# EAGLE design Buck V2.1 (EAGLE 9.4.2)
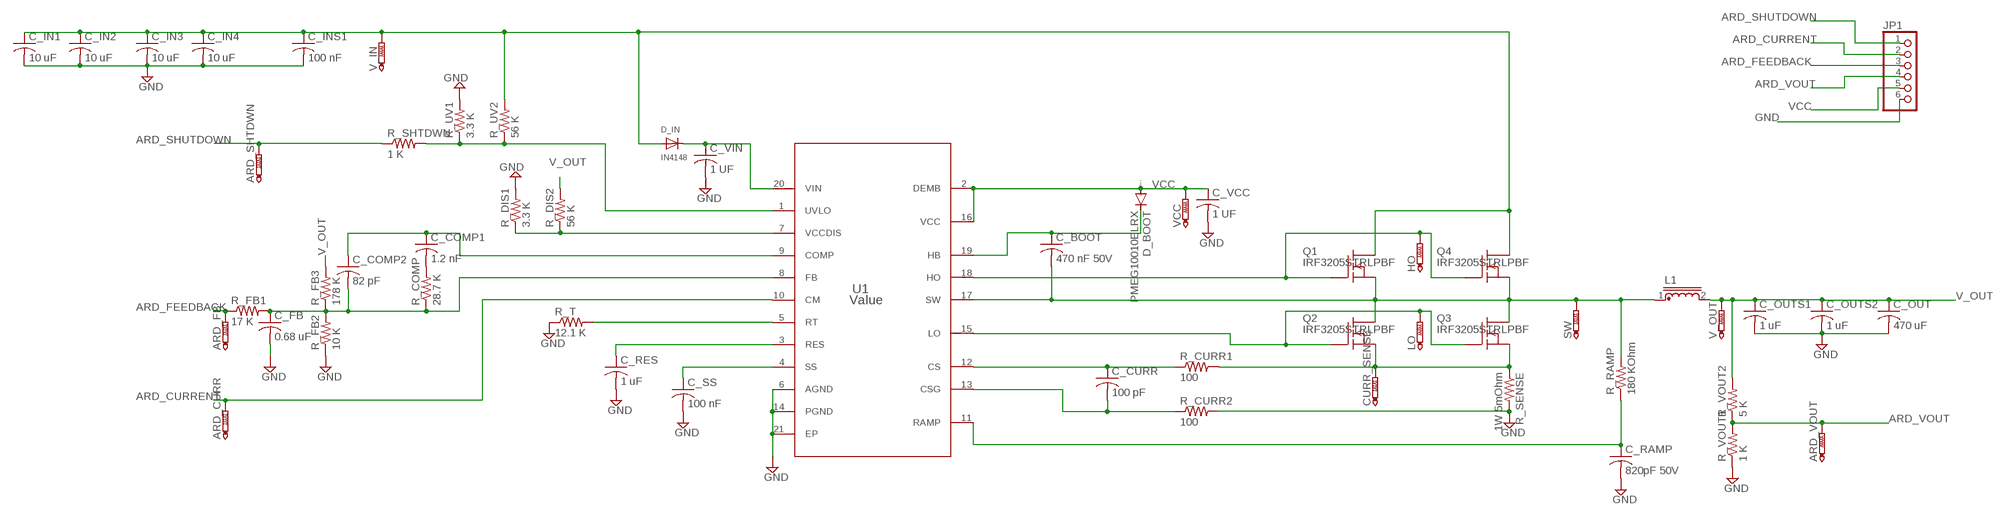
[diagram p0: schematic, sheet 1]

## Parts
ARD_CURR  PTR1TP20R  [TP20R]
ARD_FB  PTR1TP20R  [TP20R]
ARD_SHTDWN  PTR1TP20R  [TP20R]
ARD_VOUT  PTR1TP20R  [TP20R]
C_BOOT  470 nF 50V  C-USC0603  [C0603]
C_COMP1  1.2 nF  C-USC0603  [C0603]
C_COMP2  82 pF  C-USC0603  [C0603]
C_CURR  100 pF  C-USC0603  [C0603]
C_FB  0.68 uF  C-USC0603  [C0603]
C_IN1  10 uF  C-USC1206  [C1206]
C_IN2  10 uF  C-USC1206  [C1206]
C_IN3  10 uF  C-USC1206  [C1206]
C_IN4  10 uF  C-USC1206  [C1206]
C_INS1  100 nF  C-USC0603  [C0603]
C_OUT  470 uF  CAP_PANASONIC_H13  [CAP_PANASONIC_H13]
C_OUTS1  1 uF  C-USC0805  [C0805]
C_OUTS2  1 uF  C-USC0805  [C0805]
C_RAMP  820pF 50V  C-USC0603  [C0603]
C_RES  1 uF  C-USC0603  [C0603]
C_SS  100 nF  C-USC0603  [C0603]
C_VCC  1 UF  C-USC0603  [C0603]
C_VIN  1 UF  C-USC0603  [C0603]
CURR_SENSE  PTR1TP20R  [TP20R]
D_BOOT  PMEG10010ELRX  DIODE-SOD123  [SOD123]
D_IN  IN4148  DIODESOD-123  [SOD-123]
HO  PTR1TP20R  [TP20R]
JP1  PINHD-1X6  [1X06]
L1  17.5X17.5_INDUCTOR_SMD  [17.5X17.5_INDUCTOR_SMD]
LO  PTR1TP20R  [TP20R]
Q1  IRF3205STRLPBF  IRF510D2PAK  [D2PAK]
Q2  IRF3205STRLPBF  IRF510D2PAK  [D2PAK]
Q3  IRF3205STRLPBF  IRF510D2PAK  [D2PAK]
Q4  IRF3205STRLPBF  IRF510D2PAK  [D2PAK]
R_COMP  28.7 K  R-US_R0603  [R0603]
R_CURR1  100  R-US_R0603  [R0603]
R_CURR2  100  R-US_R0603  [R0603]
R_DIS1  3.3 K  R-US_R0603  [R0603]
R_DIS2  56 K  R-US_R0603  [R0603]
R_FB1  17 K  R-US_R0603  [R0603]
R_FB2  10 K  R-US_R0603  [R0603]
R_FB3  178 K  R-US_R0603  [R0603]
R_RAMP  180 KOhm  R-US_R0603  [R0603]
R_SENSE  1W 5mOhm  R-US_R2512  [R2512]
R_SHTDWN  1 K  R-US_R0603  [R0603]
R_T  12.1 K  R-US_R0603  [R0603]
R_UV1  3.3 K  R-US_R0603  [R0603]
R_UV2  56 K  R-US_R0603  [R0603]
R_VOUT1  1 K  R-US_R0603  [R0603]
R_VOUT2  5 K  R-US_R0603  [R0603]
SW  PTR1TP20R  [TP20R]
U1  Value  LM5117PMHX/NOPB  [PWP0020A]
V_IN  PTR1TP20R  [TP20R]
V_OUT  PTR1TP20R  [TP20R]
VCC  PTR1TP20R  [TP20R]

## Nets
ARD_CURRENT: ARD_CURR.TP JP1.2 U1.10(CM)
ARD_FEEDBACK: ARD_FB.TP JP1.3 R_FB1.1
ARD_SHUTDOWN: ARD_SHTDWN.TP JP1.1 R_SHTDWN.1
ARD_VOUT: ARD_VOUT.TP JP1.4 R_VOUT1.2 R_VOUT2.1
GND: C_FB.2 C_IN1.2 C_IN2.2 C_IN3.2 C_IN4.2 C_INS1.2 C_OUT.P$1 C_OUTS1.2 C_OUTS2.2 C_RAMP.2 C_RES.2 C_SS.2 C_VCC.2 C_VIN.2 JP1.6 R_CURR2.2 R_DIS1.2 R_FB2.1 R_SENSE.2 R_T.1 R_UV1.2 R_VOUT1.1 U1.6(AGND) U1.14(PGND) U1.21(EP)
N$2: C_BOOT.1 D_BOOT.C U1.19(HB)
N$3: C_BOOT.2 L1.1 Q1.3(S) Q2.2(D) Q3.2(D) Q4.3(S) R_RAMP.2 SW.TP U1.17(SW)
N$4: CURR_SENSE.TP Q2.3(S) Q3.3(S) R_CURR1.2 R_SENSE.1
N$5: C_RAMP.1 R_RAMP.1 U1.11(RAMP)
N$7: LO.TP Q2.1(G) Q3.1(G) U1.15(LO)
N$8: HO.TP Q1.1(G) Q4.1(G) U1.18(HO)
N$9: C_COMP1.2 R_COMP.2
N$10: C_VIN.1 D_IN.C U1.20(VIN)
N$11: R_SHTDWN.2 R_UV1.1 R_UV2.1 U1.1(UVLO)
N$13: R_DIS1.1 R_DIS2.1 U1.7(VCCDIS)
N$14: C_COMP1.1 C_COMP2.1 U1.9(COMP)
N$15: C_COMP2.2 C_FB.1 R_COMP.1 R_FB1.2 R_FB2.2 R_FB3.1 U1.8(FB)
N$16: R_T.2 U1.5(RT)
N$17: C_RES.1 U1.3(RES)
N$18: C_SS.1 U1.4(SS)
N$19: C_CURR.1 R_CURR1.1 U1.12(CS)
N$20: C_CURR.2 R_CURR2.1 U1.13(CSG)
N$21: C_IN1.1 C_IN2.1 C_IN3.1 C_IN4.1 C_INS1.1 D_IN.A Q1.2(D) Q4.2(D) R_UV2.2 V_IN.TP
V_OUT: C_OUT.P$2 C_OUTS1.1 C_OUTS2.1 L1.2 R_DIS2.2 R_FB3.2 R_VOUT2.2 V_OUT.TP
VCC: C_VCC.1 D_BOOT.A JP1.5 U1.2(DEMB) U1.16(VCC) VCC.TP

## Library data of the parts
ARD_CURR ARD_FB ARD_SHTDWN ARD_VOUT CURR_SENSE HO LO SW V_IN V_OUT VCC = testpad:PTR1: TEST PIN
C_BOOT C_IN4 C_OUTS1 C_OUTS2 C_RAMP C_VCC C_VIN = rcl:C-US: CAPACITOR, American symbol; SPICEPREFIX: C
C_COMP1 C_COMP2 C_CURR C_FB C_IN1-C_IN3 C_INS1 C_RES C_SS = rcl:C-US: CAPACITOR, American symbol
C_OUT = custom-parts:CAP_PANASONIC_H13
D_BOOT = diode:DIODE-: DIODE
D_IN = adafruit:DIODE: Diode SMADIODE - SMA Surface Mount Package 20V 1A Schottky Diode Digikey: 641-1014-6-ND DO-1N4148 - Through Hole Small Current Diode SOD-123 20V 1 A (.5mV Vf) Schottky Diode - Digikey: MBRX120TPMSCT-ND SOD-323 10V 570mA (.38mV Vf, 3ns) Schottky Diode - Digikey: ZLLS410CT-ND SOD-523 30V 30mA Schottky Diode (RB751S-40TE61) - Digikey: RB751S-40TE61CT-ND SOT23-R/W - SOT23 Package (R = Solder Paste/Reflow Ovens, W = Hand-Soldering) BAT54Film 40V 300mA - Digikey: 497-7162-1-ND
JP1 = adafruit:PINHD-1X6: PIN HEADER
L1 = custom-parts:17.5X17.5_INDUCTOR_SMD: YXMAC1770
Q1-Q4 = mixed_components:IRF510: N-Channel Enhancement MOSFET (HEXFET); 100V; 5,6A; 0,54Ohm
R_COMP R_CURR1 R_CURR2 R_DIS1 R_DIS2 R_FB1-R_FB3 R_SHTDWN R_T R_UV1 R_UV2 R_VOUT1 R_VOUT2 = rcl:R-US_: RESISTOR, American symbol
R_RAMP R_SENSE = rcl:R-US_: RESISTOR, American symbol; SPICEPREFIX: R
U1 = AcceleratedDesigns_Lib:LM5117PMHX/NOPB; MANUFACTURER: Texas Instruments; PARTNUMBER: LM5117PMHXNOPB; REFDES: RefDes; TYPE: TYPE

## Board
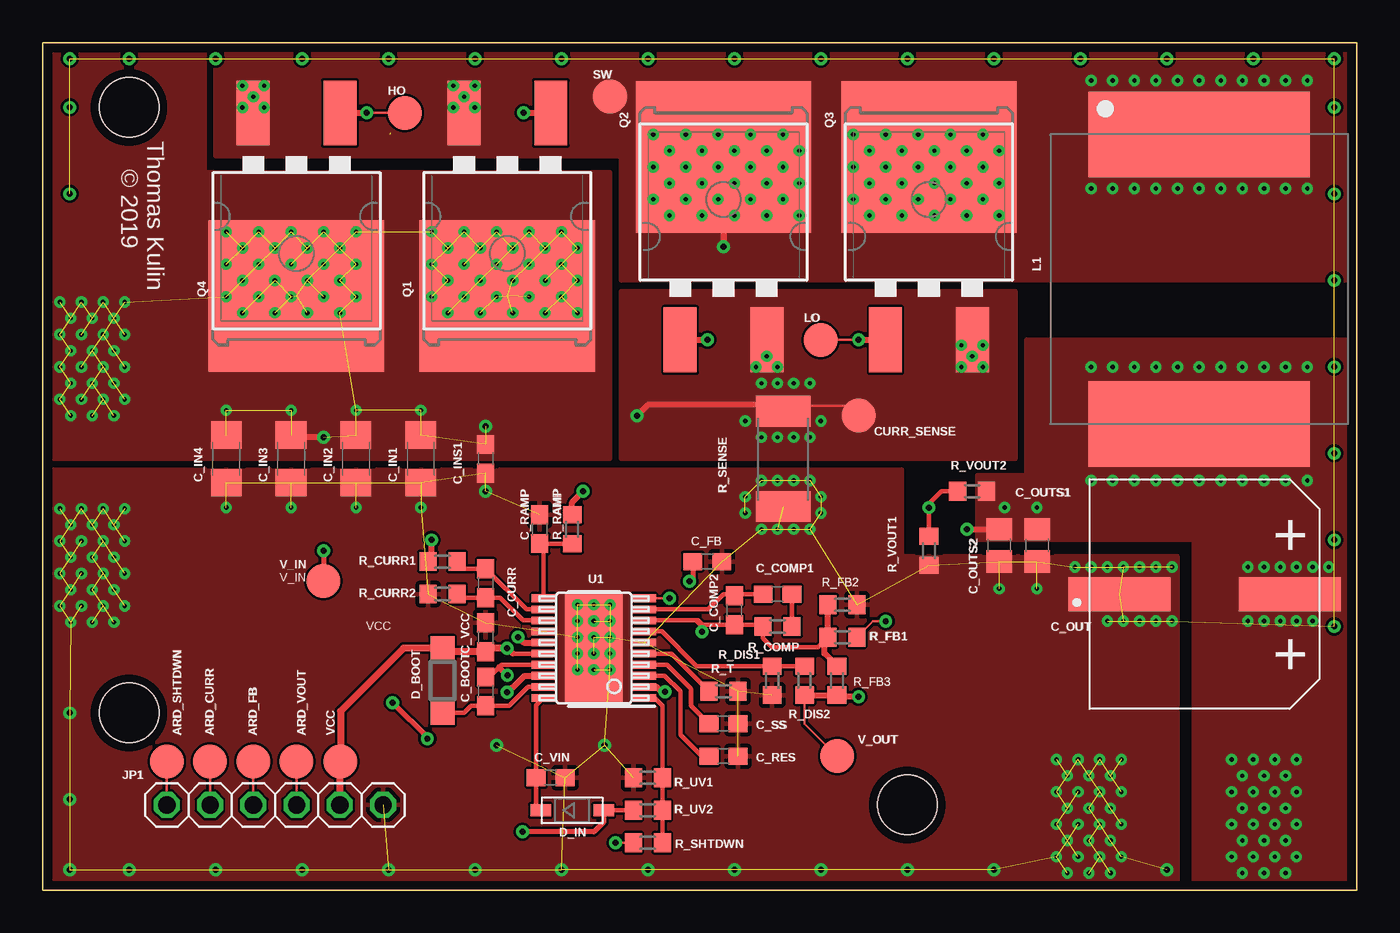
[diagram p1: board, top side]
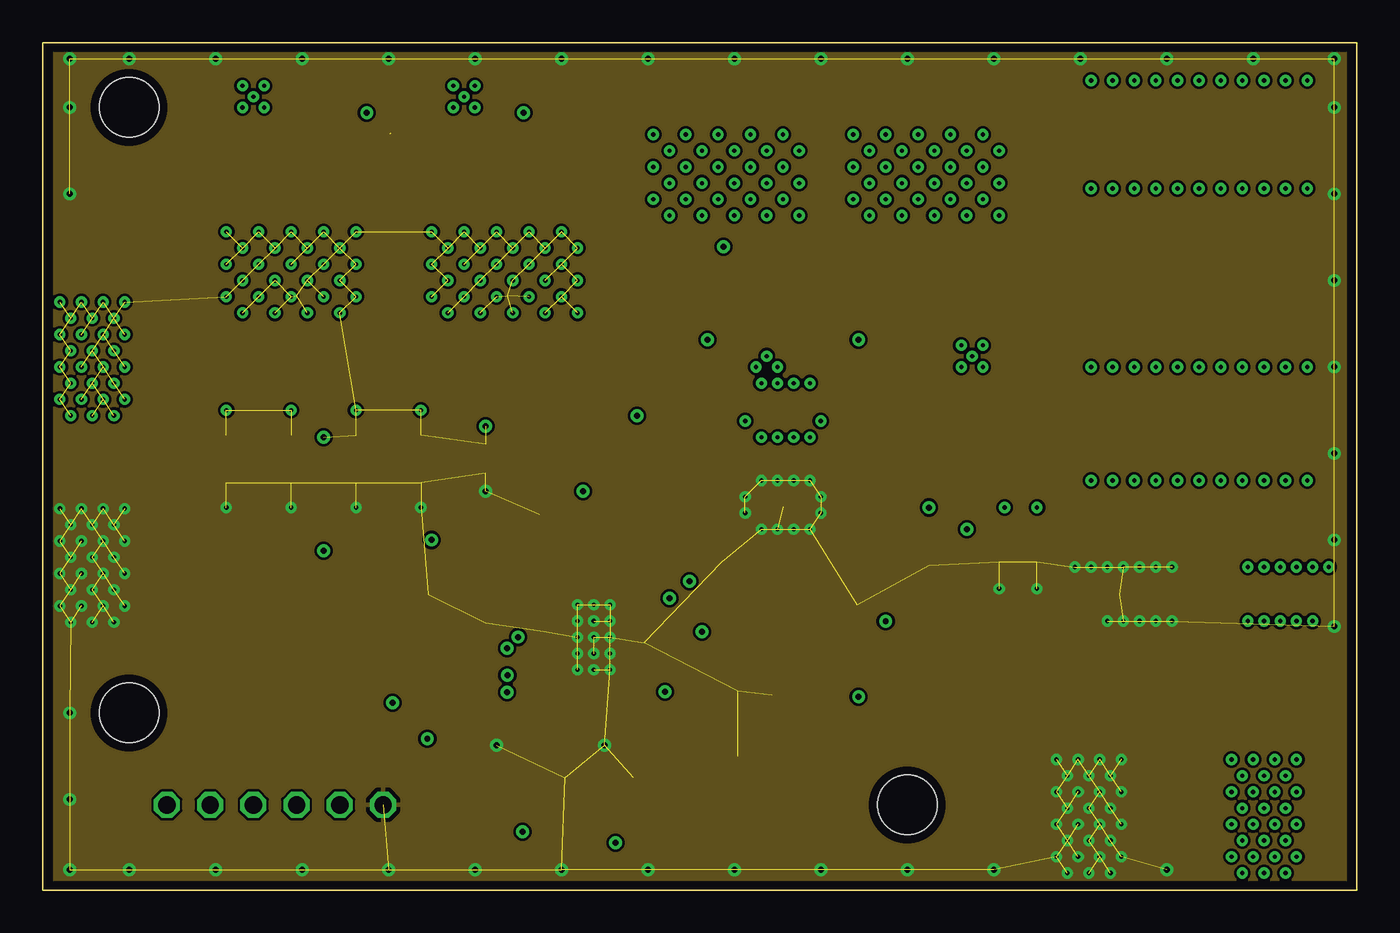
[diagram p2: board, inner layer Route2]
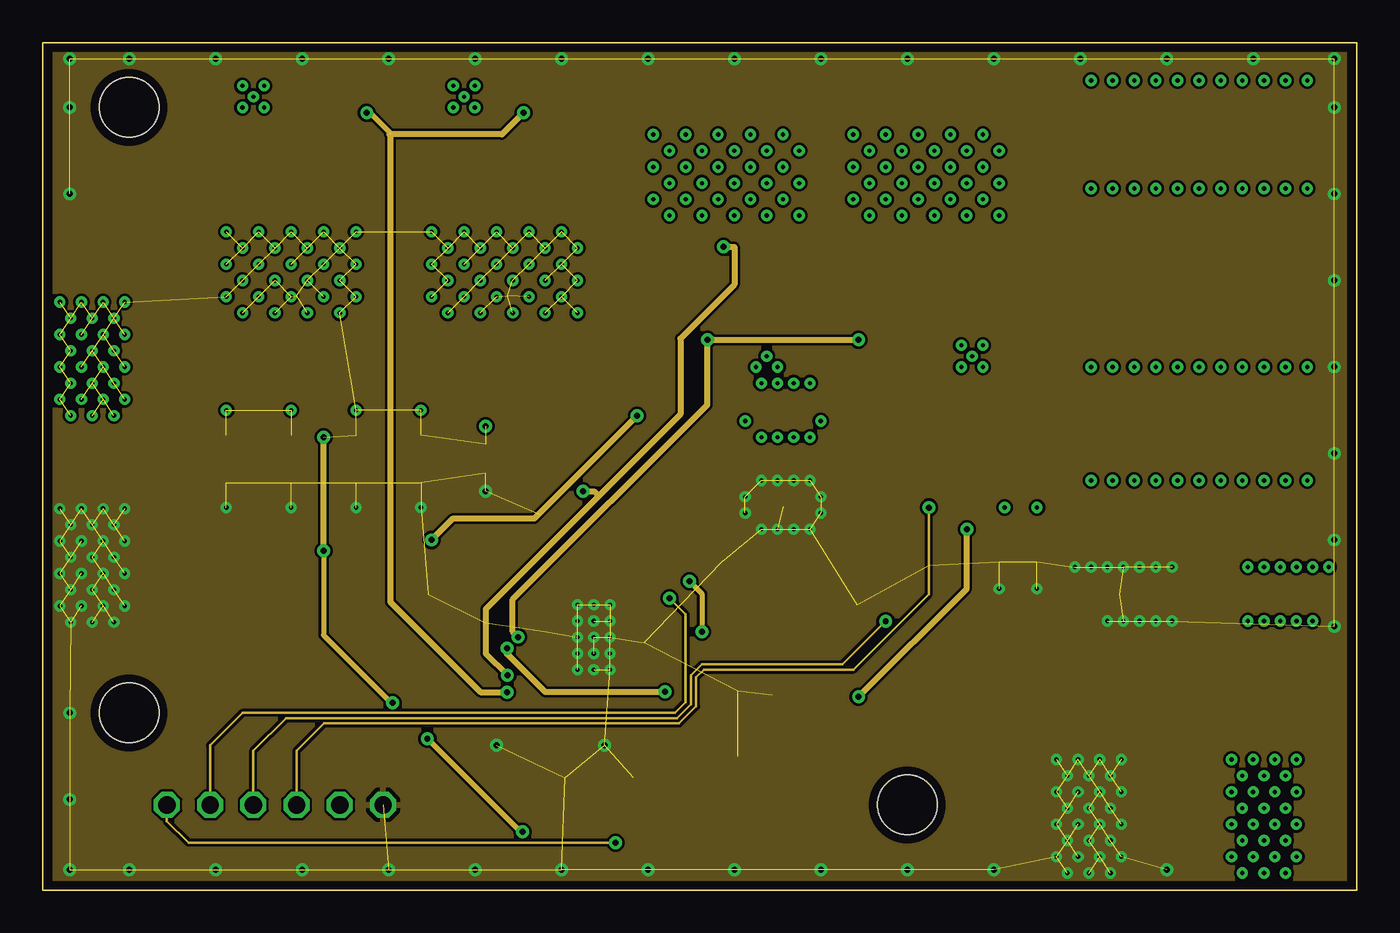
[diagram p3: board, inner layer Route15]
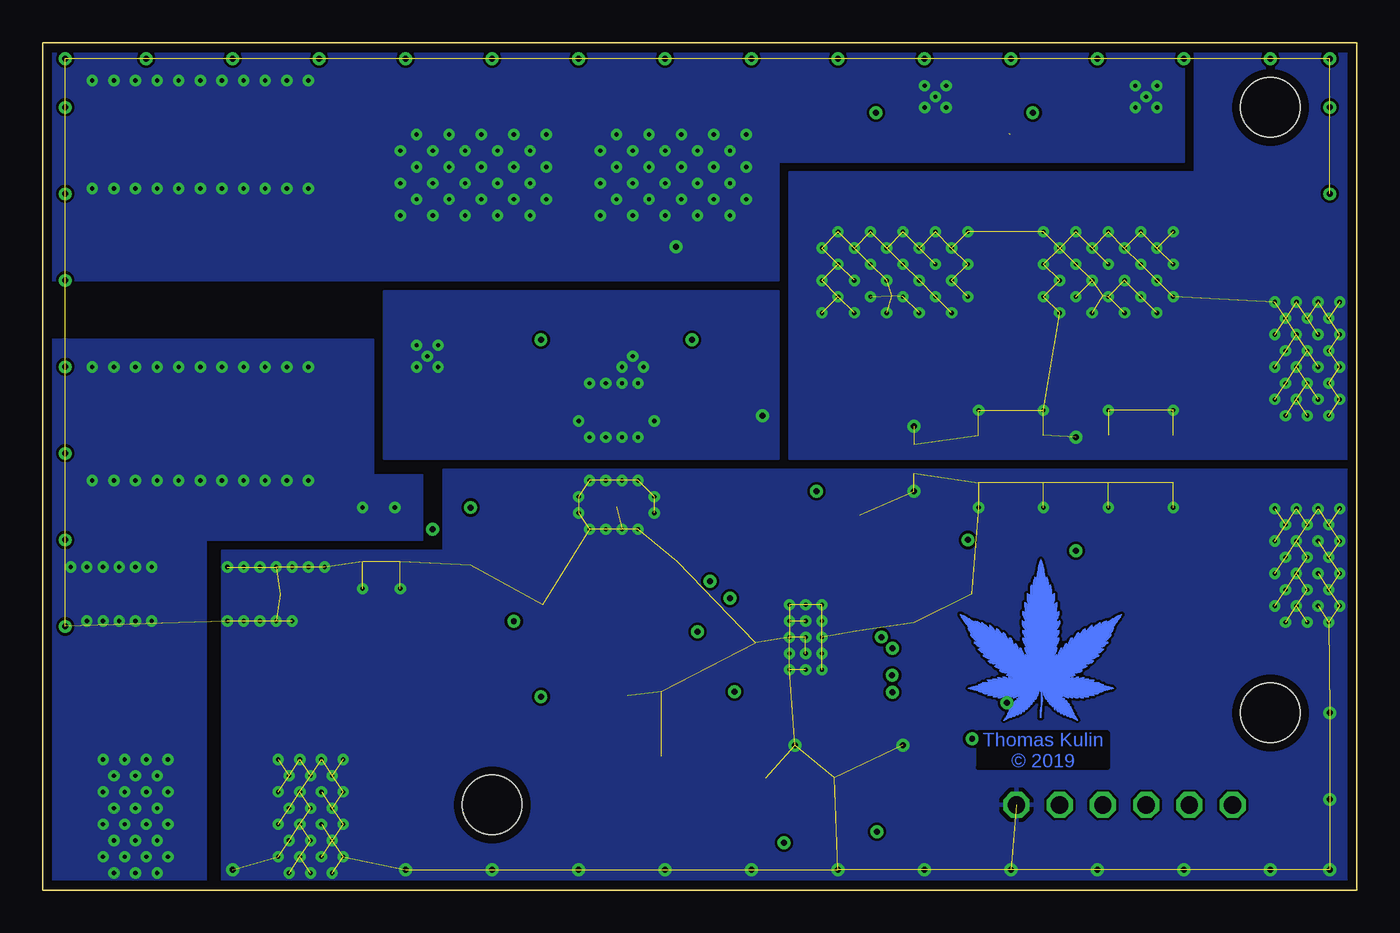
[diagram p4: board, bottom side, seen from below]

Size 77.22 x 49.78 mm. Coordinates in mm from the lower left corner, seen from the top.
Outline: 0,0 77.22,0 77.22,49.78 0,49.78 0,0
Copper layers (1+2*15+16): Top 0.035mm / dielectric 1.5mm / Route2 0.035mm / dielectric 0.15mm / Route15 0.035mm / dielectric 0.2mm / Bottom 0.035mm
Design rules "default *": minimum track width 6mil, minimum drill 0.2mm, track to track 6mil, track to pad 6mil, pad to pad 6mil, via to via 6mil, smd to smd 6mil, copper to edge 20mil, drill to drill 6mil, minimum pad ring 10mil, minimum via ring 8mil, stop-mask expansion 4mil, vias tented up to drill 0mil, thermal gap 10mil
Holes 3.48 mm at 50.8,5.02 5.08,45.97 5.08,10.41

### Footprints (pad centres in the part's own frame; a part is rotated, then mirrored left to right if it is on the bottom)
TP20R = smd 2 x 2: TP 0,0
C0603 = smd 1.1 x 1: 1 -0.85,0; 2 0.85,0
C1206 = smd 1.6 x 1.8: 1 -1.4,0; 2 1.4,0
CAP_PANASONIC_H13 = smd 6 x 2: P$1 -5,0; P$2 5,0
C0805 = smd 1.3 x 1.5: 1 -0.95,0; 2 0.95,0
SOD123 = smd 1.4 x 1.4: A 1.9,0; C -1.9,0
SOD-123 = smd 1.2 x 0.7: A 1.85,0; C -1.85,0
1X06 = drill 1.016 octagon: 1 -6.35,0; 2 -3.81,0; 3 -1.27,0; 4 1.27,0; 5 3.81,0; 6 6.35,0
17.5X17.5_INDUCTOR_SMD = smd 5 x 13: 1 0,0; 2 17,0
D2PAK = smd 1.93 x 3.81: 1 -2.55,-8.25; 3 2.55,-8.25 | smd 10.3 x 8.9: 2 0,2.5
R0603 = smd 1 x 1.1: 1 -0.85,0; 2 0.85,0
R2512 = smd 1.8 x 3.2: 1 -2.8,0; 2 2.8,0
PWP0020A = smd 1.4 x 0.45: 1 -2.95,2.925; 2 -2.95,2.275; 3 -2.95,1.625; 4 -2.95,0.975; 5 -2.95,0.325; 6 -2.95,-0.325; 7 -2.95,-0.975; 8 -2.95,-1.625; 9 -2.95,-2.275; 10 -2.95,-2.925; 11 2.95,-2.925; 12 2.95,-2.275; 13 2.95,-1.625; 14 2.95,-0.975; 15 2.95,-0.325; 16 2.95,0.325; 17 2.95,0.975; 18 2.95,1.625; 19 2.95,2.275; 20 2.95,2.925 | smd 3.4 x 6.5: 21 0,0

### Placement (x,y rotation side)
ARD_CURR  9.84,7.56 0 top
ARD_FB  12.38,7.56 0 top
ARD_SHTDWN  7.3,7.56 0 top
ARD_VOUT  14.92,7.56 0 top
C_BOOT  26.04,11.68 90 top
C_COMP1  43.18,17.4 0 top
C_COMP2  40.64,16.45 270 top
C_CURR  26.04,18.03 270 top
C_FB  39.05,19.3 0 top
C_IN1  22.23,25.34 270 top
C_IN2  18.41,25.34 270 top
C_IN3  14.61,25.34 270 top
C_IN4  10.79,25.34 270 top
C_INS1  26.04,25.34 270 top
C_OUT  68.26,17.4 0 top
C_OUTS1  58.42,20.26 270 top
C_OUTS2  56.2,20.26 270 top
C_RAMP  29.21,21.21 90 top
C_RES  40.01,7.87 0 top
C_SS  40.01,9.78 0 top
C_VCC  26.04,14.86 90 top
C_VIN  29.84,6.6 0 top
CURR_SENSE  47.94,27.88 0 top
D_BOOT  23.5,12.32 90 top
D_IN  31.11,4.7 0 top
HO  21.27,45.66 0 top
JP1  13.65,5.02 0 top
L1  67.94,44.39 270 top
LO  45.72,32.32 0 top
Q1  27.3,37.4 180 top
Q2  40.01,40.58 0 top
Q3  52.07,40.58 0 top
Q4  14.92,37.4 180 top
R_COMP  43.18,15.49 0 top
R_CURR1  23.5,19.3 180 top
R_CURR2  23.5,17.4 180 top
R_DIS1  42.86,12.32 270 top
R_DIS2  44.77,12.32 270 top
R_FB1  46.99,14.86 180 top
R_FB2  46.99,16.76 180 top
R_FB3  46.67,12.32 270 top
R_RAMP  31.11,21.21 90 top
R_SENSE  43.5,25.34 270 top
R_SHTDWN  35.56,2.79 0 top
R_T  40.01,11.68 180 top
R_UV1  35.56,6.6 180 top
R_UV2  35.56,4.7 180 top
R_VOUT1  52.07,19.94 90 top
R_VOUT2  54.61,23.43 0 top
SW  33.34,46.61 0 top
U1  32.38,14.22 180 top
V_IN  16.51,18.16 0 top
V_OUT  46.67,7.87 0 top
VCC  17.5,7.57 0 top

### Tracks (layer width: path | path; a pad name or v marks a point on that pad's centre or on a via)
ARD_CURRENT  (via drill 0.35)
  Top 0.152: U1.10 v36.83,17.16 | JP1.2 ARD_CURR.TP
  Route15 0.152: v36.83,17.16 37.78,16.2 37.78,11.05 37.15,10.41 11.75,10.41 9.84,8.51 JP1.2
ARD_FEEDBACK  (via drill 0.35)
  Top 0.152: R_FB1.1 48.79,15.81 v49.53,15.81 | JP1.3 ARD_FB.TP
  Route15 0.152: JP1.3 12.38,8.19 14.3,10.11 37.27,10.11 38.09,10.92 38.09,12.62 38.73,13.27 46.99,13.27 v49.53,15.81
ARD_SHUTDOWN  (via drill 0.35)
  Top 0.152: R_SHTDWN.1 v33.66,2.79 | JP1.1 ARD_SHTDWN.TP
  Route15 0.152: v33.66,2.79 8.57,2.79 7.3,4.06 JP1.1
ARD_VOUT  (via drill 0.35)
  Top 0.152: JP1.4 ARD_VOUT.TP
  Top 0.254: R_VOUT2.1 52.81,23.43 52.07,22.69 v52.07,22.48 R_VOUT1.2
  Route15 0.152: JP1.4 14.92,8.19 16.54,9.8 37.4,9.8 38.39,10.8 38.39,12.5 38.85,12.95 47.62,12.95 52.07,17.4 v52.07,22.48
GND  (via drill 0.25, 0.35)  (168 unrouted)
  other vias: 1.59,1.21 5.08,1.21 10.16,1.21 15.24,1.21 20.32,1.21 25.4,1.21 1.59,5.33 1.59,10.41 30.48,1.21 35.56,1.21 40.64,1.21 45.72,1.21 50.8,1.21 55.88,1.21 66.04,1.21 75.88,15.49 75.88,20.57 75.88,25.65 75.88,30.73 75.88,35.81 75.88,40.89 75.88,45.97 1.59,40.89 1.59,45.97 1.59,48.83 5.08,48.83 10.16,48.83 15.24,48.83 20.32,48.83 25.4,48.83 30.48,48.83 35.56,48.83 40.64,48.83 45.72,48.83 50.8,48.83 55.88,48.83 60.96,48.83 66.04,48.83 71.12,48.83 75.88,48.83 32.38,16.76 31.43,16.76 33.34,16.76 31.43,15.81 32.38,15.81 33.34,15.81 31.43,14.86 32.38,14.86 33.34,14.86 31.43,13.91 32.38,13.91 33.34,13.91 31.43,12.95 32.38,12.95 33.34,12.95 56.2,17.72 58.42,17.72 41.27,23.11 41.27,22.16 42.23,21.21 43.18,21.21 44.13,21.21 45.09,21.21 42.23,24.07 43.18,24.07 44.13,24.07 45.09,24.07 45.72,23.11 45.72,22.16 10.79,22.48 14.61,22.48 18.41,22.48 22.23,22.48 60.64,18.99 61.59,18.99 62.55,18.99 63.5,18.99 64.45,18.99 65.41,18.99 66.36,18.99 66.36,15.81 65.41,15.81 64.45,15.81 63.5,15.81 62.55,15.81 59.56,7.68 60.83,7.68 62.1,7.68 63.37,7.68 60.2,6.73 61.47,6.73 62.74,6.73 59.56,5.78 60.83,5.78 62.1,5.78 63.37,5.78 60.2,4.83 61.47,4.83 62.74,4.83 59.56,3.87 60.83,3.87 62.1,3.87 63.37,3.87 60.2,2.92 61.47,2.92 62.74,2.92 59.56,1.97 60.83,1.97 62.1,1.97 63.37,1.97 60.2,1.02 61.47,1.02 62.74,1.02 1.02,22.42 2.29,22.42 3.56,22.42 4.83,22.42 1.65,21.46 2.92,21.46 4.19,21.46 1.02,20.51 2.29,20.51 3.56,20.51 4.83,20.51 1.65,19.56 2.92,19.56 4.19,19.56 1.02,18.61 2.29,18.61 3.56,18.61 4.83,18.61 1.65,17.65 2.92,17.65 4.19,17.65 1.02,16.7 2.29,16.7 3.56,16.7 4.83,16.7 1.65,15.75 2.92,15.75 4.19,15.75 26.67,8.51 33.02,8.51 26.04,23.43
  pour Top: 0.32,24.7 50.48,24.7 50.48,19.62 66.67,19.62 66.67,0.32 0.32,0.32
  pour Route15: 0.32,49.47 77.15,49.47 77.15,0.25 0.32,0.25
  pour Route2: 0.64,49.66 0.64,0.25 77.15,0.25 77.15,49.66
  pour Bottom: 0.25,24.7 53.66,24.7 53.66,19.94 66.67,19.94 66.67,0.44 0.25,0.44
  pour Top (no thermals): 8.57,24.7 50.48,24.7 50.48,19.62 66.67,19.62 66.67,15.18 59.05,15.18 59.05,16.76 49.21,16.76 49.21,20.57 32.7,20.57 32.7,24.07 27.3,24.07 27.3,22.16 8.57,22.16
  pour Top (no thermals): 28.26,18.03 36.51,18.03 36.51,10.41 28.26,10.41
N$2
  Top 0.254: U1.19 28.52,11.95 27.41,10.83 C_BOOT.1 25.18,10.83 24.77,10.41 D_BOOT.C
N$3  (via drill 0.25, 0.35)
  Top 0.254: U1.17 26.96,13.25 26.83,13.11 26.14,12.43 C_BOOT.2
  Top 0.356: Q2.2 v40.01,37.79 | v27.3,12.64 26.83,13.11 | R_RAMP.2 31.11,22.8 v31.75,23.43
  Route15 0.356: v40.01,37.79 40.64,37.79 40.64,35.57 37.47,32.4 37.47,27.95 32.67,23.15 | 32.67,23.15 26.04,16.52 26.04,13.91 v27.3,12.64 | 32.67,23.15 32.38,23.43 v31.75,23.43
  other vias: 35.88,44.39 36.83,43.43 37.78,44.39 38.73,43.43 39.69,44.39 40.64,43.43 41.59,44.39 42.55,43.43 43.5,44.39 44.45,43.43 35.88,42.48 37.78,42.48 39.69,42.48 41.59,42.48 43.5,42.48 36.83,41.53 38.73,41.53 40.64,41.53 42.55,41.53 44.45,41.53 43.5,40.58 41.59,40.58 39.69,40.58 37.78,40.58 35.88,40.58 36.83,39.62 38.73,39.62 40.64,39.62 42.55,39.62 44.45,39.62 47.62,44.39 48.58,43.43 49.53,44.39 50.48,43.43 51.44,44.39 52.39,43.43 53.34,44.39 54.29,43.43 55.24,44.39 56.2,43.43 47.62,42.48 49.53,42.48 51.44,42.48 53.34,42.48 55.24,42.48 48.58,41.53 50.48,41.53 52.39,41.53 54.29,41.53 56.2,41.53 55.24,40.58 53.34,40.58 51.44,40.58 49.53,40.58 47.62,40.58 48.58,39.62 50.48,39.62 52.39,39.62 54.29,39.62 56.2,39.62 61.59,47.56 62.87,47.56 64.14,47.56 65.41,47.56 66.67,47.56 67.94,47.56 69.22,47.56 70.48,47.56 71.75,47.56 73.03,47.56 74.3,47.56 61.59,41.21 62.87,41.21 64.14,41.21 65.41,41.21 66.67,41.21 67.94,41.21 69.22,41.21 70.48,41.21 71.75,41.21 73.03,41.21 74.3,41.21 11.75,47.24 13.02,47.24 12.38,46.61 11.75,45.97 13.02,45.97 24.13,47.24 25.4,47.24 24.77,46.61 24.13,45.97 25.4,45.97
  pour Top (no thermals): 10.16,49.66 10.16,43.12 33.97,43.12 33.97,35.81 77.09,35.81 77.09,49.66
  pour Bottom: 10.16,49.53 77.03,49.53 77.03,35.81 33.97,35.81 33.97,42.8 10.16,42.8
N$4  (via drill 0.25, 0.35)
  Top 0.152: R_SENSE.1 43.81,28.45 47.37,28.45 CURR_SENSE.TP
  Top 0.356: R_CURR1.2 22.86,19.52 v22.86,20.57 | v34.92,27.88 35.56,28.51 43.12,28.51 R_SENSE.1
  Route15 0.356: v22.86,20.57 24.13,21.84 28.89,21.84 v34.92,27.88
  other vias: 41.27,27.56 45.72,27.56 42.23,29.78 45.09,29.78 42.23,26.61 43.18,26.61 44.13,26.61 45.09,26.61 41.91,30.73 43.18,30.73 42.55,31.37 53.98,30.73 55.24,30.73 54.61,31.37 53.98,32 55.24,32 43.18,29.78 44.13,29.78
  pour Top (no thermals): 33.97,35.18 33.97,25.34 57.15,25.34 57.15,35.18
  pour Bottom: 33.97,35.18 57.15,35.18 57.15,25.34 33.97,25.34
N$5
  Top 0.254: U1.11 29.43,20.13 C_RAMP.1 R_RAMP.1
N$7  (via drill 0.35)
  Top 0.152: LO.TP v47.94,32.33
  Top 0.356: Q2.1 v39.05,32.33 v39.05,32.32 | v47.94,32.32 v47.94,32.33 Q3.1 | v27.94,14.87 28.27,14.55 U1.15
  Route15 0.356: v47.94,32.32 v39.05,32.32 39.05,28.51 27.62,17.08 27.62,15.19 v27.94,14.87
N$8  (via drill 0.35)  (1 unrouted)
  Top 0.152: v19.05,45.66 HO.TP
  Top 0.356: Q4.1 v19.05,45.65 v19.05,45.66 | v28.26,45.66 Q1.1 | U1.18 28.31,12.6 27.6,11.88 27.53,11.88 v27.28,11.64
  Top 0.457: Q4.1
  Route15 0.305: 20.45,44.45 19.24,45.66 v19.05,45.66
  Route15 0.356: 20.38,44.39 26.99,44.39 v28.26,45.66 | v27.28,11.64 25.73,11.64 20.45,16.92 20.45,44.45
N$9
  Top 0.254: C_COMP1.2 R_COMP.2
N$10
  Top 0.254: U1.20 29,10.86 C_VIN.1 29,4.97 D_IN.C
N$11
  Top 0.254: U1.1 35.95,11.3 36.41,10.83 R_UV1.1 R_UV2.1 R_SHTDWN.2
N$13
  Top 0.254: U1.7 36.39,15.2 38.42,13.17 R_DIS1.1 R_DIS2.1
N$14
  Top 0.254: U1.9 39.1,16.5 40.01,17.4 40.54,17.4 C_COMP2.1 40.74,17.4 C_COMP1.1
N$15  (via drill 0.35)
  Top 0.254: U1.8 38.42,15.85 38.51,15.85 38.76,15.6 C_COMP2.2 42.23,15.6 R_COMP.1 42.33,14.8 42.86,14.27 45.55,14.27 45.93,14.65 R_FB1.2
  Top 0.305: C_FB.1 38.2,18.35 v38,18.15 | v38.73,15.18 38.73,15.53 38.42,15.85
  Top 0.356: R_FB3.1 45.93,13.91 45.93,14.65 | R_FB1.2 R_FB2.2
  Route15 0.305: v38,18.15 38.73,17.42 v38.73,15.18
N$16
  Top 0.254: R_T.2 36.94,13.9 U1.5
N$17
  Top 0.254: U1.3 36.55,12.6 37.47,11.68 37.47,9.14 38.73,7.87 C_RES.1
N$18
  Top 0.254: U1.4 36.7,13.25 38.1,11.85 38.1,10.83 C_SS.1
N$19
  Top 0.254: U1.12 28.42,16.5 C_CURR.1 24.77,18.88 R_CURR1.1
N$20
  Top 0.254: U1.13 28.22,15.85 26.89,17.18 C_CURR.2 24.56,17.18 R_CURR2.1
N$21  (via drill 0.25, 0.35)  (96 unrouted)
  Top 0.254: R_UV2.2 D_IN.A
  Top 0.305: D_IN.A 32.97,4.01 32.38,3.43 v28.19,3.43 | v16.51,19.94 V_IN.TP | v20.57,11.02 22.61,8.99 v22.61,8.89
  Top 0.356: v16.51,26.61 14.73,26.61 C_IN3.1
  Route15 0.305: v16.51,19.94 16.51,14.99 20.57,10.92 v20.57,11.02 | v22.61,8.89 28.07,3.43 v28.19,3.43
  Route15 0.356: v16.51,19.94 v16.51,26.61
  other vias: 10.79,38.67 11.75,37.72 12.7,38.67 13.65,37.72 14.61,38.67 15.56,37.72 16.51,38.67 17.46,37.72 18.41,38.67 10.79,36.77 12.7,36.77 14.61,36.77 16.51,36.77 18.41,36.77 11.75,35.81 13.65,35.81 15.56,35.81 17.46,35.81 18.41,34.86 16.51,34.86 14.61,34.86 12.7,34.86 10.79,34.86 11.75,33.91 13.65,33.91 15.56,33.91 17.46,33.91 22.86,38.67 23.81,37.72 24.77,38.67 25.72,37.72 26.67,38.67 27.62,37.72 28.57,38.67 29.53,37.72 30.48,38.67 31.43,37.72 22.86,36.77 24.77,36.77 26.67,36.77 28.57,36.77 30.48,36.77 23.81,35.81 25.72,35.81 27.62,35.81 29.53,35.81 31.43,35.81 30.48,34.86 28.57,34.86 26.67,34.86 24.77,34.86 22.86,34.86 23.81,33.91 25.72,33.91 27.62,33.91 29.53,33.91 31.43,33.91 10.79,28.19 14.61,28.19 18.41,28.19 22.23,28.19 1.02,34.54 2.29,34.54 3.56,34.54 4.83,34.54 1.65,33.59 2.92,33.59 4.19,33.59 1.02,32.64 2.29,32.64 3.56,32.64 4.83,32.64 1.65,31.69 2.92,31.69 4.19,31.69 1.02,30.73 2.29,30.73 3.56,30.73 4.83,30.73 1.65,29.78 2.92,29.78 4.19,29.78 1.02,28.83 2.29,28.83 3.56,28.83 4.83,28.83 1.65,27.88 2.92,27.88 4.19,27.88 26.04,27.24
  pour Top (no thermals): 9.53,49.15 9.53,42.16 33.34,42.16 33.34,25.34 0.32,25.34 0.32,49.15
  pour Bottom: 0.19,49.78 9.53,49.78 9.53,42.16 33.34,42.16 33.34,25.34 0.19,25.34
V_OUT  (via drill 0.25, 0.35)
  Top 0.152: V_OUT.TP 44.77,9.78 R_DIS2.2
  Top 0.356: v54.29,21.21 C_OUTS2.1 | v47.94,11.37 46.77,11.37 R_FB3.2 R_DIS2.2
  Route15 0.356: v54.29,21.21 54.29,17.72 v47.94,11.37
  other vias: 75.56,18.99 74.61,18.99 73.66,18.99 72.71,18.99 71.75,18.99 70.8,18.99 70.8,15.81 71.75,15.81 72.71,15.81 73.66,15.81 74.61,15.81 61.59,30.73 62.87,30.73 64.14,30.73 65.41,30.73 66.67,30.73 67.94,30.73 69.22,30.73 70.48,30.73 71.75,30.73 73.03,30.73 74.3,30.73 61.59,24.07 62.87,24.07 64.14,24.07 65.41,24.07 66.67,24.07 67.94,24.07 69.22,24.07 70.48,24.07 71.75,24.07 73.03,24.07 74.3,24.07 58.42,22.48 56.52,22.48 69.85,7.68 71.12,7.68 72.39,7.68 73.66,7.68 70.48,6.73 71.75,6.73 73.03,6.73 69.85,5.78 71.12,5.78 72.39,5.78 73.66,5.78 70.48,4.83 71.75,4.83 73.03,4.83 69.85,3.87 71.12,3.87 72.39,3.87 73.66,3.87 70.48,2.92 71.75,2.92 73.03,2.92 69.85,1.97 71.12,1.97 72.39,1.97 73.66,1.97 70.48,1.02 71.75,1.02 73.03,1.02
  pour Top (no thermals): 57.78,32.32 77.09,32.32 77.09,0.06 67.63,0.06 67.63,20.57 54.93,20.57 54.93,24.38 57.78,24.38
  pour Bottom: 57.78,32.32 76.96,32.32 76.96,0.38 67.63,0.38 67.63,20.57 54.93,20.57 54.93,24.38 57.78,24.38
VCC  (via drill 0.35)
  Top 0.152: D_BOOT.A
  Top 0.254: U1.16 27.62,13.9 | 26.14,13.9 C_VCC.1 25.82,14.22
  Top 0.356: 27.62,13.9 27.32,14.21 v27.29,14.21 | U1.2 36.08,11.95 36.37,11.65 v36.57,11.65
  Top 0.406: v27.29,14.21 26.23,14.21 C_VCC.1 23.7,14.01 D_BOOT.A 21.2,14.22 17.5,10.52 VCC.TP 17.46,7.53 JP1.5
  Route15 0.356: v27.29,14.21 27.29,13.89 29.52,11.65 v36.57,11.65
(copper drawn outside any net)
  shapes: Bottom area x966

### Text on the board
Bottom: Thomas Kulin / © 2019
_tNames: SW | HO | Q2 | Q3 | Thomas Kulin / © 2019 | L1 | Q4 | Q1 | LO | R_SENSE | CURR_SENSE | C_IN4 | C_IN3 | C_IN2 | C_IN1 | C_INS1 | R_VOUT2 | C_OUTS1 | C_RAMP | R_RAMP | R_CURR1 | C_FB | C_CURR | C_COMP1 | R_VOUT1 | V_IN | R_CURR2 | U1 | R_FB2 | C_OUTS2 | VCC | C_COMP2 | R_COMP | R_FB1 | C_OUT | C_VCC | R_DIS1 | R_T | R_FB3 | D_BOOT | C_BOOT | R_DIS2 | ARD_SHTDWN | ARD_CURR | ARD_FB | ARD_VOUT | VCC | C_SS | V_OUT | C_VIN | C_RES | JP1 | R_UV1 | R_UV2 | D_IN | R_SHTDWN